# EAGLE design attiny85 breakout (EAGLE 7.4.0)
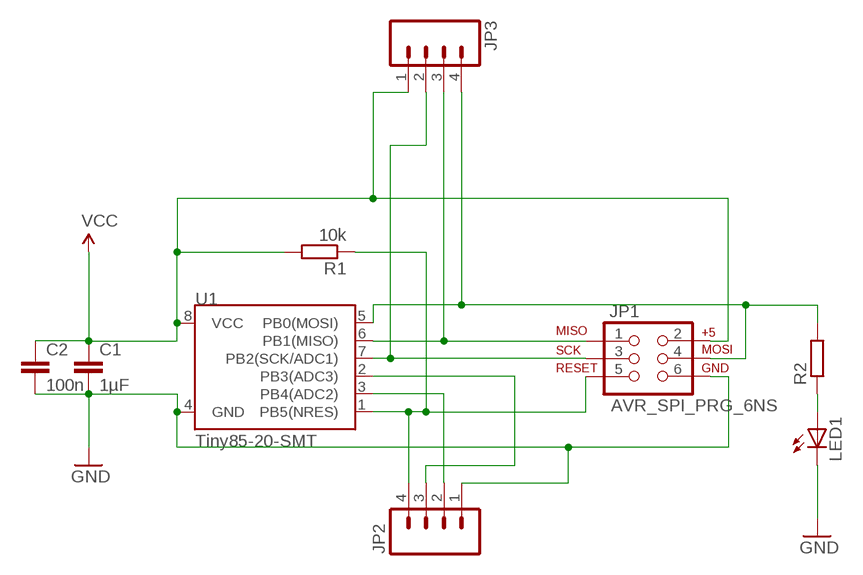
[diagram p0: schematic, sheet 1]

## Parts
C1  1µF  C-EUC0805  [C0805]
C2  100n  C-EUC0805  [C0805]
JP1  AVR_SPI_PRG_6NS  [2X3-NS]
JP2  M04PTH  [1X04]
JP3  M04PTH  [1X04]
LED1  LEDCHIPLED_0805  [CHIPLED_0805]
R1  10k  R-EU_R0805  [R0805]
R2  R-EU_R0603  [R0603]
U1  Tiny85-20-SMT  ATTINY45TINY85-20-SMT  [SO08-EIAJ]

## Nets
GND: C1.2 C2.2 JP1.6 JP2.1 LED1.C U1.4(GND)
N$1: LED1.A R2.1
N$2: JP1.5 JP2.4 R1.1 U1.1(PB5(NRES))
N$3: JP1.1 JP3.3 U1.6(PB1(MISO))
N$4: JP1.4 JP3.4 R2.2 U1.5(PB0(MOSI))
N$6: JP1.3 JP3.2 U1.7(PB2(SCK/ADC1))
N$8: JP2.3 U1.2(PB3(ADC3))
N$9: JP2.2 U1.3(PB4(ADC2))
VCC: C1.1 C2.1 JP1.2 JP3.1 R1.2 U1.8(VCC)

## Library data of the parts
C1 C2 = rcl:C-EU: CAPACITOR, European symbol
JP1 = SparkFun-Connectors:AVR_SPI_PRG_6: AVR ISP 6 Pin This is the reduced ISP connector for AVR programming. Common on Arduino. This footprint will take up less PCB space and can be used with a 10-pin to 6-pin adapter such as SKU: BOB-08508 **Special note about "TEST_POINT" package. The stop mask is on the top side, so if you want your programming test points to be on the bottom of your board, make sure to place this package on the bottom side of the board. This also ensure that the orientation to program from the bottom side will be correct.
JP2 JP3 = SparkFun-Connectors:M04: Header 4 Standard 4-pin 0.1" header. Use with straight break away headers (SKU : PRT-00116), right angle break away headers (PRT-00553), swiss pins (PRT-00743), machine pins (PRT-00117), and female headers (PRT-00115). Molex polarized connector foot print use with SKU : PRT-08231 with associated crimp pins and housings. 1MM SMD Version SKU: PRT-10208
LED1 = adafruit:LED: LED OSRAM: - CHIPLED LG R971, LG N971, LY N971, LG Q971, LY Q971, LO R971, LY R971 LH N974, LH R974 LS Q976, LO Q976, LY Q976 LO Q996 - Hyper CHIPLED LW Q18S LB Q993, LB Q99A, LB R99A - SideLED LS A670, LO A670, LY A670, LG A670, LP A670 LB A673, LV A673, LT A673, LW A673 LH A674 LY A675 LS A676, LA A676, LO A676, LY A676, LW A676 LS A679, LY A679, LG A679 - Hyper Micro SIDELED® LS Y876, LA Y876, LO Y876, LY Y876 LT Y87S - SmartLED LW L88C, LW L88S LB L89C, LB L89S, LG L890 LS L89K, LO L89K, LY L89K LS L896, LA L896, LO L896, LY L896 - TOPLED LS T670, LO T670, LY T670, LG T670, LP T670 LSG T670, LSP T670, LSY T670, LOP T670, LYG T670 LG T671, LOG T671, LSG T671 LB T673, LV T673, LT T673, LW T673 LH T674 LS T676, LA T676, LO T676, LY T676, LB T676, LH T676, LSB T676, LW T676 LB T67C, LV T67C, LT T67C, LS T67K, LO T67K, LY T67K, LW E67C LS E67B, LA E67B, LO E67B, LY E67B, LB E67C, LV E67C, LT E67C LW T67C LS T679, LY T679, LG T679 LS T770, LO T770, LY T770, LG T770, LP T770 LB T773, LV T773, LT T773, LW T773 LH T774 LS E675, LA E675, LY E675, LS T675 LS T776, LA T776, LO T776, LY T776, LB T776 LHGB T686 LT T68C, LB T68C - Hyper Mini TOPLED® LB M676 - Mini TOPLED Santana® LG M470 LS M47K, LO M47K, LY M47K Source: http://www.osram.convergy.de/
R1 R2 = rcl:R-EU_: RESISTOR, European symbol
U1 = SparkFun-DigitalIC:ATTINY45: Atmel 8-pin 2/4/8kB flash uC; PROD_ID: IC-09092

## Board
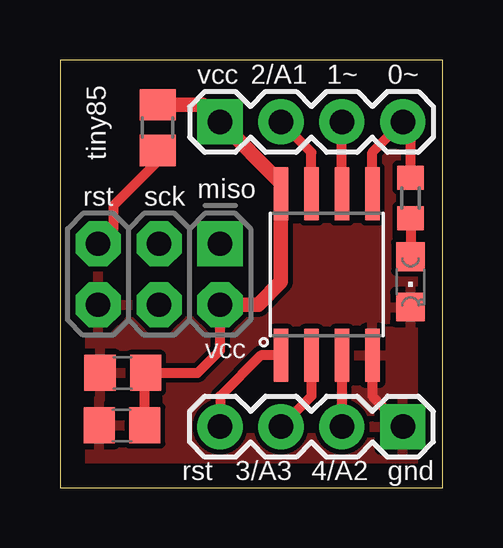
[diagram p1: board, top side]
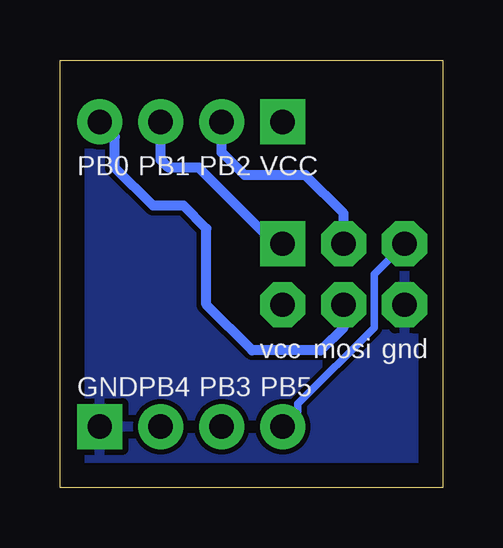
[diagram p2: board, bottom side, seen from below]

Size 15.94 x 17.82 mm. Coordinates in mm from the lower left corner, seen from the top.
Outline: 0,0 15.94,0 15.94,17.82 0,17.82 0,0
Copper layers (1*16): Top 0.035mm / dielectric 1.5mm / Bottom 0.035mm
Design rules "default": minimum track width 10mil, minimum drill 24mil, track to track 8mil, track to pad 8mil, pad to pad 8mil, via to via 8mil, smd to smd 8mil, copper to edge 40mil, drill to drill 8mil, minimum pad ring 10mil, minimum via ring 8mil, stop-mask expansion 4mil, vias tented up to drill 0mil, thermal gap 10mil

### Footprints (pad centres in the part's own frame; a part is rotated, then mirrored left to right if it is on the bottom)
C0805 = smd 1.3 x 1.5: 1 -0.95,0; 2 0.95,0
2X3-NS = drill 1.016 pad 1.88 square: 1 -2.54,-1.27 | drill 1.016 pad 1.88 octagon: 2 -2.54,1.27; 3 0,-1.27; 4 0,1.27; 5 2.54,-1.27; 6 2.54,1.27
1X04 = drill 1.016 pad 1.88 square: 1 0,0 | drill 1.016 pad 1.88: 2 2.54,0; 3 5.08,0; 4 7.62,0
CHIPLED_0805 = smd 1.2 x 1.2: A 0,-1.05; C 0,1.05
R0805 = smd 1.3 x 1.5: 1 -0.95,0; 2 0.95,0
R0603 = smd 1 x 1.1: 1 -0.85,0; 2 0.85,0
SO08-EIAJ = smd 0.61 x 2.21: 1 -1.905,-3.378; 2 -0.635,-3.378; 3 0.635,-3.378; 4 1.905,-3.378; 5 1.905,3.353; 6 0.635,3.353; 7 -0.635,3.353; 8 -1.905,3.353

### Placement (x,y rotation side)
C1  2.58,2.59 180 top
C2  2.62,4.78 180 top
JP1  4.13,8.89 180 top
JP2  14.29,2.54 180 top
JP3  6.67,15.24 0 top
LED1  14.61,8.57 180 top
R1  4.07,15 90 top
R2  14.61,12.06 90 top
U1  11.11,8.89 0 top

### Tracks (layer width: path | path; a pad name or v marks a point on that pad's centre or on a via)
GND
  Top 0.406: U1.4 13.02,3.81 JP2.1
  pour Top: -1.91,18.73 -1.91,-0.95 17.46,-0.95 17.46,18.73 -1.59,18.73
  pour Bottom: -0.64,18.1 -0.64,-0.64 16.51,-0.64 16.51,18.1
N$1
  Top 0.406: R2.1 LED1.A
N$2  (via drill 0.6)
  Top 0.406: U1.1 8.37,5.51 6.67,3.81 JP2.4 | R1.1 4.07,13.59 2.22,11.75 2.22,10.79 JP1.5
  Bottom 0.305: JP1.5 2.86,8.89 2.86,6.67 6.03,3.49 6.03,3.17 JP2.4
  other vias: 1.59,10.16
N$3
  Top 0.406: U1.6 JP3.3
  Bottom 0.406: JP1.1 6.99,10.16 10.16,13.34 11.43,13.34 11.75,13.65 JP3.3
N$4
  Top 0.406: U1.5 13.02,13.97 JP3.4 14.6,14.92 R2.2
  Bottom 0.406: JP1.4 4.13,6.67 5.08,5.71 7.94,5.71 9.84,7.62 9.84,10.79 10.79,11.75 12.07,11.75 13.65,13.34 13.65,14.61 JP3.4
N$6
  Top 0.406: U1.7 10.48,13.97 JP3.2
  Bottom 0.406: JP1.3 4.13,11.43 5.71,13.02 8.26,13.02 9.21,13.97 JP3.2
N$8
  Top 0.406: U1.2 10.48,3.81 JP2.3
N$9
  Top 0.406: U1.3 JP2.2
VCC
  Top 0.406: C1.1 3.53,4.75 C2.1 5.74,4.78 6.67,5.71 JP1.2
  Top 0.61: JP1.2 8.26,7.62 9.21,8.57 U1.8 9.21,12.7 JP3.1 5.96,15.95 R1.2

### Text on the board
tPlace: vcc | 2/A1 | 1~ | 0~ | tiny85 | rst | sck | miso | vcc | rst | 3/A3 | 4/A2 | gnd
bPlace: VCC | PB2 | PB1 | PB0 | gnd | mosi | vcc | PB5 | PB3 | PB4 | GND